# Altium schematic sheet Bluetooth.SchDoc
size A4
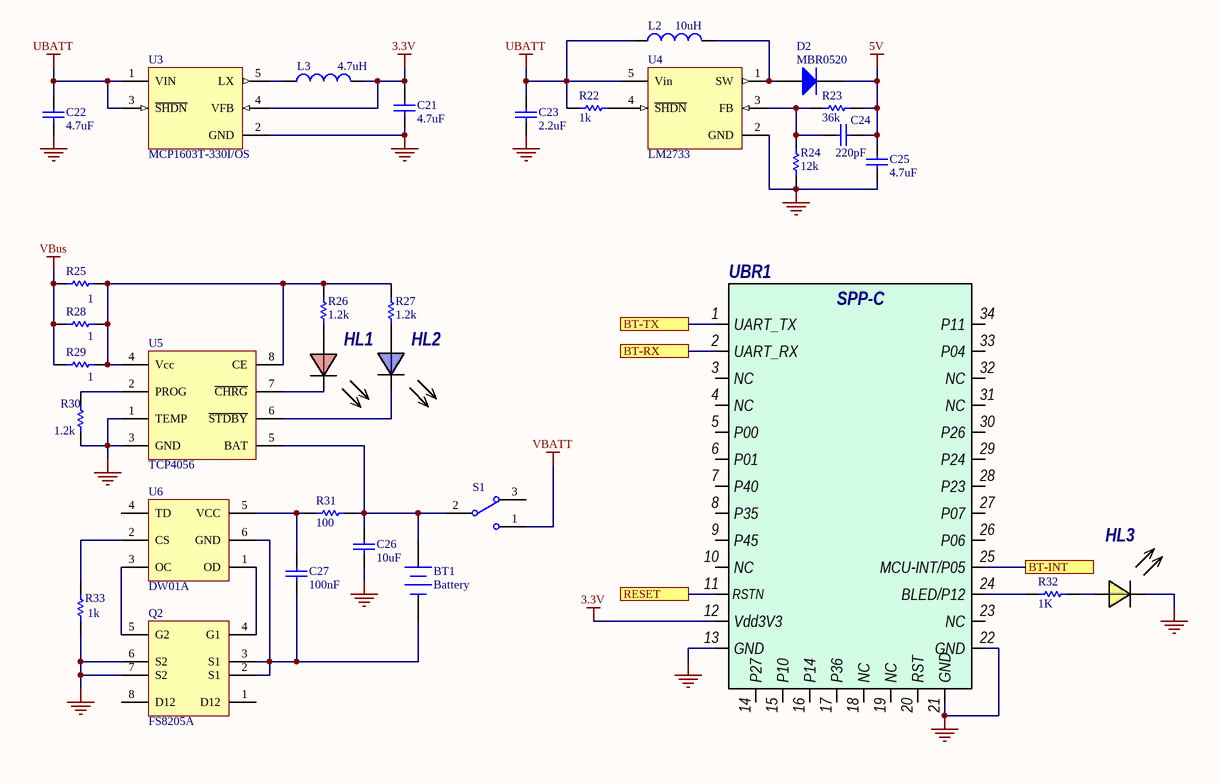
[diagram p0: Bluetooth.SchDoc]

## Parts
BT1  Battery  [BAT-2]
C21  value 4.7uF  [RAD-0.3]  (hidden comment: Cap)
C22  value 4.7uF  [RAD-0.3]  (hidden comment: Cap)
C23  value 2.2uF  [RAD-0.3]  (hidden comment: Cap)
C24  value 220pF  [RAD-0.3]  (hidden comment: Cap)
C25  value 4.7uF  [RAD-0.3]  (hidden comment: Cap)
C26  value 10uF  [RAD-0.3]  (hidden comment: Cap)
C27  value 100nF  [RAD-0.3]  (hidden comment: Cap)
D2  MBR0520  [SOD323/A]
HL1  LED_Red  [0603_Red]  (value not drawn)
HL2  LED_Blue  [0603_Blue]  (value not drawn)
HL3  Yellow  [0603_Yellow]  (value not drawn)
L2  value 10uH  [0402-A]  (hidden comment: Inductor)
L3  value 4.7uH  [0402-A]  (hidden comment: Inductor)
Q2  FS8205A  [TSSOP8]
R22  value 1k  [AXIAL-0.3]  (hidden comment: Res1)
R23  value 36k  [AXIAL-0.3]  (hidden comment: Res1)
R24  value 12k  [AXIAL-0.3]  (hidden comment: Res1)
R25  value 1  [AXIAL-0.3]  (hidden comment: Res1)
R26  value 1.2k  [AXIAL-0.3]  (hidden comment: Res1)
R27  value 1.2k  [AXIAL-0.3]  (hidden comment: Res1)
R28  value 1  [AXIAL-0.3]  (hidden comment: Res1)
R29  value 1  [AXIAL-0.3]  (hidden comment: Res1)
R30  value 1.2k  [AXIAL-0.3]  (hidden comment: Res1)
R31  value 100  [AXIAL-0.3]  (hidden comment: Res1)
R32  value 1K  [AXIAL-0.3]  (hidden comment: Res1)
R33  value 1k  [AXIAL-0.3]  (hidden comment: Res1)
S1  SW-SPDT  [TL36WW15050]  (value not drawn)
U3  MCP1603T-330I/OS  [SOT23_5]
U4  LM2733  [SOT23_5]
U5  TCP4056  [SO8]
U6  DW01A  [SOT23_6]
UBR1  SPP-C  [SPP-C]  (value not drawn)

## Ports
BT-INT, BT-RX, BT-TX, RESET

## Nets
3.3V: C21.2 L3.2 U3.4(VFB) UBR1.12(Vdd3V3)
5V: C24.1 C25.2 D2.2(K) R23.1
GND: C21.1 C22.1 C23.1 C25.1 C26.1 HL3.C Q2.6(S2) Q2.7(S2) R24.2 R30.1 R33.1 U3.2(GND) U4.2(GND) U5.1(TEMP) U5.3(GND) UBR1.13(GND) UBR1.21(GND) UBR1.22(GND)
UBATT: C22.2 C23.2 L2.1 R22.2 U3.1(VIN) U3.3(~{SHDN}) U4.5(Vin)
VBATT: S1.1
VBus: R25.2 R28.2 R29.2
BT-INT: UBR1.25(MCU-INT/P05) ; port BT-INT
BT-RX: UBR1.2(UART_RX) ; port BT-RX
BT-TX: UBR1.1(UART_TX) ; port BT-TX
RESET: UBR1.11(RSTN) ; port RESET
NetBT1_1: BT1.1(+) C26.2 R31.1 S1.2 U5.5(BAT)
NetBT1_2: BT1.2(-) C27.1 Q2.2(S1) Q2.3(S1) U6.6(GND)
NetC24_2: C24.2 R23.2 R24.1 U4.3(FB)
NetC27_2: C27.2 R31.2 U6.5(VCC)
NetD2_1: D2.1(A) L2.2 U4.1(SW)
NetHL1_A: HL1.A R26.1
NetHL1_C: HL1.C U5.7(~{CHRG})
NetHL2_A: HL2.A R27.1
NetHL2_C: HL2.C U5.6(~{STDBY})
NetHL3_A: HL3.A R32.1
NetL3_1: L3.1 U3.5(LX)
NetQ2_4: Q2.4(G1) U6.1(OD)
NetQ2_5: Q2.5(G2) U6.3(OC)
NetR22_1: R22.1 U4.4(~{SHDN})
NetR25_1: R25.1 R26.2 R27.2 R28.1 R29.1 U5.4(Vcc) U5.8(CE)
NetR30_2: R30.2 U5.2(PROG)
NetR32_2: R32.2 UBR1.24(BLED/P12)
NetR33_2: R33.2 U6.2(CS)

Not connected (* = marked no-connect by the designer): Q2 1(D12) 8(D12); S1 3; U6 4(TD); UBR1 3(NC) 4(NC) 5(P00) 6(P01) 7(P40) 8(P35) 9(P45) 10(NC) 14(P27) 15(P10) 16(P14) 17(P36) 18(NC) 19(NC) 20(RST) 23(NC) 26(P06) 27(P07) 28(P23) 29(P24) 30(P26) 31(NC) 32(NC) 33(P04) 34(P11)

## Library data of the parts
BT1 = Battery: Multicell Battery; Published: 24-Mar-1999; LatestRevisionDate: 17-Jul-2002; LatestRevisionNote: Re-released for DXP Platform.; PackageReference: BAT-2; Publisher: Altium Limited; PackageDescription: Battery; 2 Leads
C21-C27 = Cap: Capacitor; Published: 8-Jun-2000; LatestRevisionDate: 17-Jul-2002; LatestRevisionNote: Re-released for DXP Platform.; PackageReference: RAD-0.3; Publisher: Altium Limited; PackageDescription: Radial Cap, Thru-Hole; 2 Leads; 0.3 in Pin Spacing
D2 = BAT60JFILM: Manuf_1: STM; Code - JEDEC: DO-214-AB; Provided: ST; Published: 8-Jun-2000; Revision: July-2002: Re-released for DXP Platform.; Publisher: Altium Limited; Order: BAT60JFILM; Manuf_Part_1: BAT60JFILM
HL1 = LED_Red: LED Red
HL2 = LED_Blue: LED Blue
HL3 = LED_Yellow: LED Yellow
L2 L3 = Inductor: Code_IEC: 1005; Published: 8-Jun-2000; LatestRevisionDate: 29-May-2009; LatestRevisionNote: IPC-7351 Footprint Added.; PackageReference: 0402-A; Publisher: Altium Limited; PackageDescription: Chip Inductor; Code_JEITA: 0402
R22-R33 = Res1: Resistor; Published: 8-Jun-2000; LatestRevisionDate: 17-Jul-2002; LatestRevisionNote: Re-released for DXP Platform.; PackageReference: AXIAL-0.3; Publisher: Altium Limited; PackageDescription: Axial Device, Thru-Hole; 2 Leads; 0.3 in Pin Spacing
S1 = SW-SPDT: SPDT Subminiature Toggle Switch, Right Angle Mounting, Vertical Actuation; Published: 24-Mar-1999; LatestRevisionDate: 17-Dec-2003; LatestRevisionNote: Schematic revised, PCB Footprint replaced.; DatasheetVersion: 05-Dec-2000; PackageReference: TL36WW15050; Publisher: Altium Limited; PackageDescription: Switch; 4 Leads; ComponentLink1Description: Manufacturer Link; ComponentLink1URL: http://www.apem.com
U3 = MCP1603T-330I/OS: 500mA Synchronous Buck Regulator, 3.3V, 2.0 MHz, 5-Pin TSOT, Industrial Temperature, Tape and Reel; Published: 29-Jan-2009; DatasheetVersion: revA, May-2007; PackageVersion: revBB, Aug-2009; PackageReference: TSOT-OS5; Publisher: Altium Limited; PackageDescription: 5-Lead Plastic Small Outline Transistor (OS) [TSOT]; Supplier 1: Digi-Key; Supplier Part Number 1: MCP1603T-330I/OSTR-ND; Supplier 2: Digi-Key; Supplier Part Number 2: MCP1603T-330I/OSCT-ND; Supplier 3: Digi-Key; Supplier Part Number 3: MCP1603T-330I/OSDKR-ND; Supplier 4: Farnell; Supplier Part Number 4: 1439373; ComponentLink1Description: Datasheet; ComponentLink1URL: http://ww1.microchip.com/downloads/en/DeviceDoc/22042a.pdf; ComponentLink2Description: Packaging Specification; ComponentLink2URL: http://www.microchip.com/stellent/groups/techpub_sg/documents/packagingspec/en012702.pdf
U4 = LM2733: 0.6/1.6 MHz Boost Converters With 40V Internal FET Switch; Published: 29-Jan-2009; DatasheetVersion: revA, May-2007; PackageVersion: revBB, Aug-2009; PackageReference: TSOT-OS5; Publisher: Altium Limited; PackageDescription: 5-Lead Plastic Small Outline Transistor (OS) [TSOT]; Supplier Part Number 1: MCP1603T-330I/OSTR-ND; Supplier 2: Digi-Key; Supplier Part Number 2: MCP1603T-330I/OSCT-ND; Supplier 3: Digi-Key; Supplier Part Number 3: MCP1603T-330I/OSDKR-ND; Supplier 4: Farnell; Supplier Part Number 4: 1439373; ComponentLink1Description: Datasheet; ComponentLink1URL: http://ww1.microchip.com/downloads/en/DeviceDoc/22042a.pdf; ComponentLink2Description: Packaging Specification; ComponentLink2URL: http://www.microchip.com/stellent/groups/techpub_sg/documents/packagingspec/en012702.pdf
U5 = TP4056
UBR1 = SPP-C: Bluetooth Module